# Altium schematic sheet BH1750原理图.SchDoc
size A4
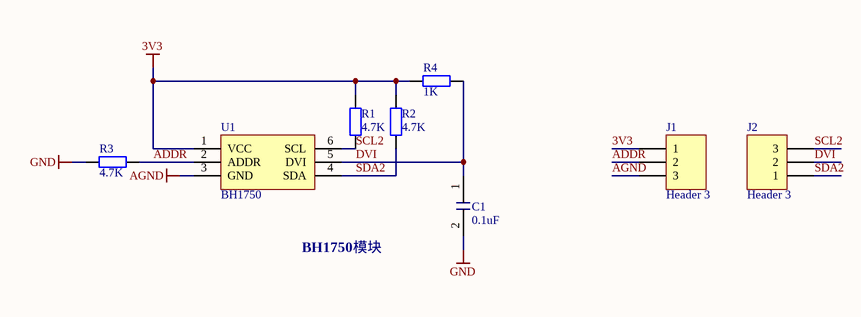
[diagram p0: BH1750原理图.SchDoc]

## Parts
C1  无极性贴片电容  [C 0603_M]  (value not drawn)
J1  Header 3  [HDR1X3]
J2  Header 3  [HDR1X3]
R1  value 4.7K  [R 0603_L]  (hidden comment: Res2)
R2  value 4.7K  [R 0603_L]  (hidden comment: Res2)
R3  value 4.7K  [R 0603_L]  (hidden comment: Res2)
R4  value 1K  [R 0603_L]  (hidden comment: Res2)
U1  BH1750  [BH1750FVI]

## Nets
3V3: J1.1 R1.2 R2.2 R4.2 U1.1(VCC)
AGND: J1.3 U1.3(GND)
GND: C1.2 R3.2
ADDR: J1.2 R3.1 U1.2(ADDR)
DVI: C1.1 J2.2 R4.1 U1.5(DVI)
SCL2: J2.3 R1.1 U1.6(SCL)
SDA2: J2.1 R2.1 U1.4(SDA)

## Notes on the sheet
- BH1750模块
- (in symbol 贴片电容) 0.1uF

## Library data of the parts
C1 = 贴片电容
J1 J2 = Header 3: Header, 3-Pin; LatestRevisionDate: 17-Jul-2002; LatestRevisionNote: Re-released for DXP Platform.; Publisher: Altium Limited
R1-R4 = Res2: Resistor; Published: 8-Jun-2000; LatestRevisionDate: 17-Jul-2002; LatestRevisionNote: Re-released for DXP Platform.; PackageReference: AXIAL-0.4; Publisher: Altium Limited